# EAGLE design CC1101Adapter_V1_00 (EAGLE 6.4)
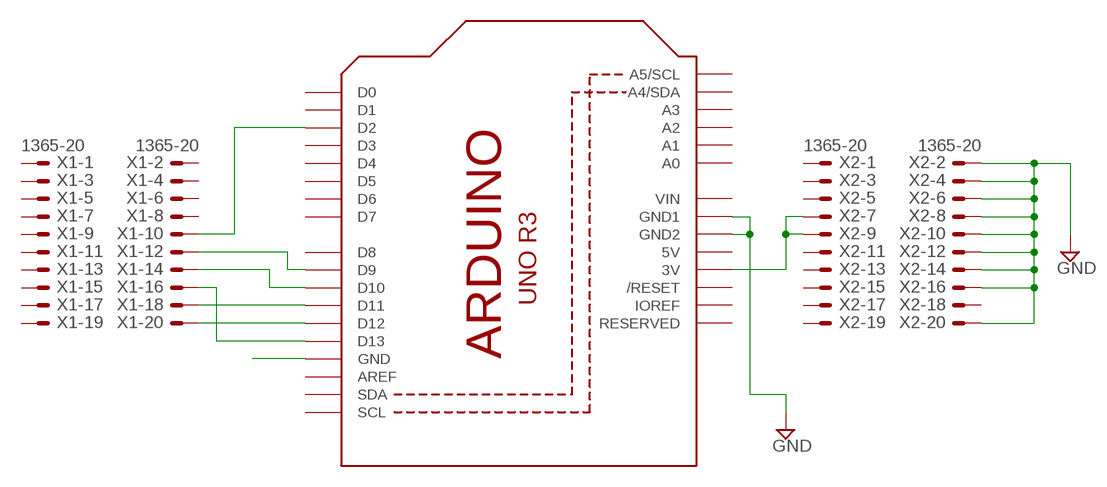
[diagram p0: schematic, sheet 1]

## Parts
U1  ARDUINOR3-DIMENSION  [ARDUINOR3]
X1  1365-20  [1365-20]
X2  1365-20  [1365-20]

## Nets
GND: U1.GND1 U1.GND2 X2.2 X2.4 X2.6 X2.8 X2.10 X2.12 X2.14 X2.16 X2.20
N$1: U1.D10 X1.14
N$2: U1.D11 X1.18
N$3: U1.D12 X1.20
N$4: U1.D13 X1.16
N$5: U1.D2 X1.10
N$6: U1.D9 X1.12
N$7: U1.3V X2.7 X2.9
N$8: U1.GND
Unconnected: U1.A0 U1.A1 U1.A2 U1.A3 U1.A4(A4/SDA) U1.A5(A5/SCL) U1.AREF U1.D0 U1.D1 U1.D3 U1.D4 U1.D5 U1.D6 U1.D7 U1.D8 U1.IOREF U1.RESERVED U1.RESET(/RESET) U1.SCL U1.SDA X1.1 X1.2 X1.3 X1.4 X1.5 X1.6 X1.7 X1.8 X1.9 X1.11 X1.13 X1.15 X1.17 X1.19 X2.1 X2.3 X2.5 X2.11 X2.13 X2.15 X2.17 X2.18 X2.19

## Power pins joined to a net without a drawn wire
5V: U1.5V
VIN: U1.VIN

## Library data of the parts
U1 = adafruit-fh:ARDUINOR3: This is a new object for the new Arduino R3 - with extra pins that you may want to use (such as IOref, and duplicated A4/A5
X1 X2 = con-leotronics:1365-20: DUAL ROW STRAIGHT HEADER 1364 SERIES. 1.27mm x 1.27mm. Without Fixing Post. SMT Source: http://www.leotronics.co.uk/Conexcon/Data%20Sheets/sec.%20A/1364ing.pdf; OC_FARNELL: unknown; OC_NEWARK: unknown

## Board
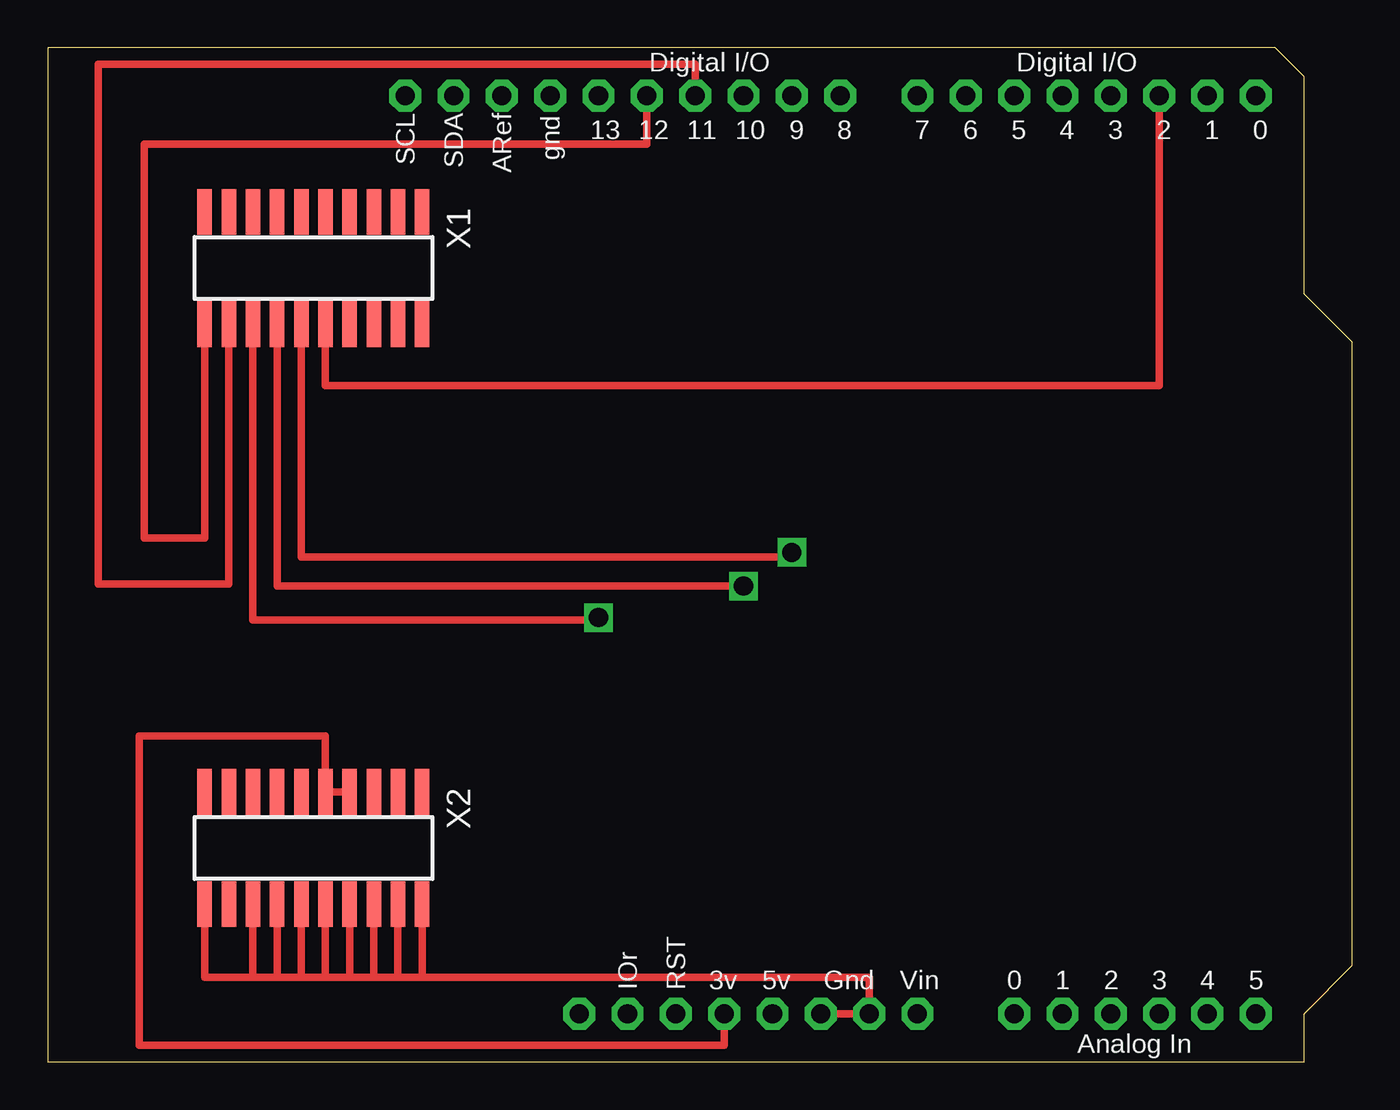
[diagram p1: board, top side]
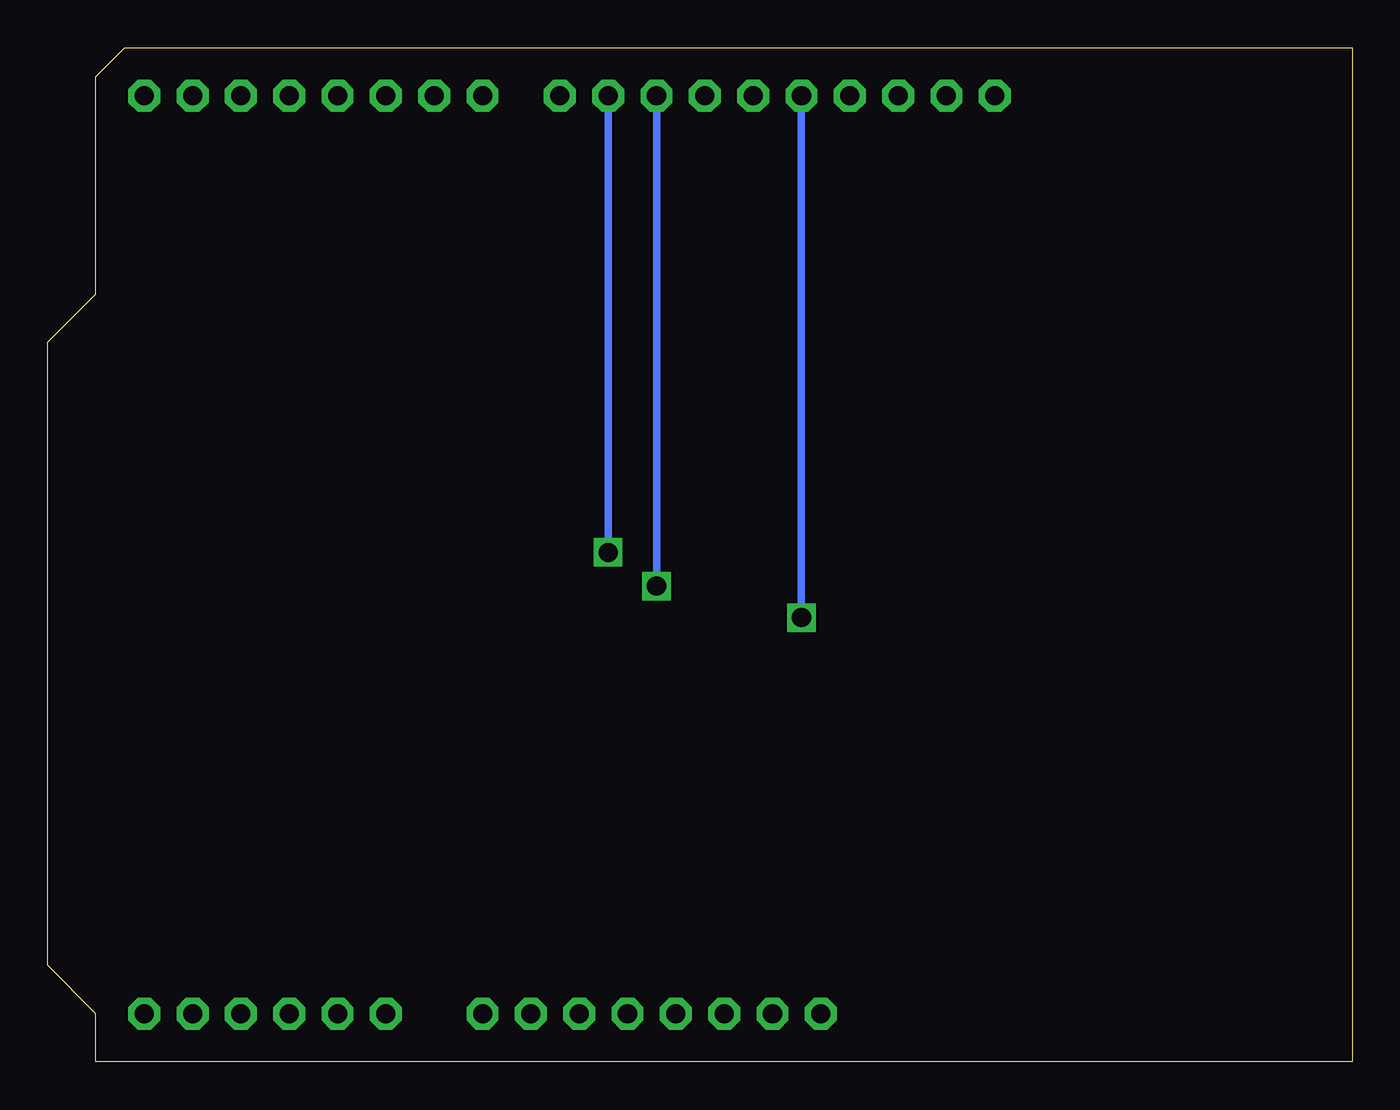
[diagram p2: board, bottom side, seen from below]

Size 68.58 x 53.34 mm. Coordinates in mm from the lower left corner, seen from the top.
Copper layers (1*16): Top 0.0356mm / dielectric 1.5011mm / Bottom 0.0356mm
Design rules "LaenPCBOrder": minimum track width 6mil, minimum drill 13mil, track to track 6mil, track to pad 6mil, pad to pad 6mil, via to via 6mil, smd to smd 6mil, copper to edge 15mil, drill to drill 6mil, minimum pad ring 7mil, minimum via ring 7mil, stop-mask expansion 4mil, vias tented up to drill 0mil, thermal gap 10mil

### Footprints (pad centres in the part's own frame; a part is rotated, then mirrored left to right if it is on the bottom)
ARDUINOR3 = drill 1 pad 1.676 octagon: 3V 35.56,2.54; 5V 38.1,2.54; A0 50.8,2.54; A1 53.34,2.54; A2 55.88,2.54; A3 58.42,2.54; A4 60.96,2.54; A5 63.5,2.54; AREF 23.876,50.8; D0 63.5,50.8; D1 60.96,50.8; D2 58.42,50.8; D3 55.88,50.8; D4 53.34,50.8; D5 50.8,50.8; D6 48.26,50.8; D7 45.72,50.8; D8 41.656,50.8; D9 39.116,50.8; D10 36.576,50.8; D11 34.036,50.8; D12 31.496,50.8; D13 28.956,50.8; GND 26.416,50.8; GND1 43.18,2.54; GND2 40.64,2.54; IOREF 30.48,2.54; RESERVED 27.94,2.54; RESET 33.02,2.54; SCL 18.796,50.8; SDA 21.336,50.8; VIN 45.72,2.54
1365-20 = smd 0.76 x 2.4: 1 -5.715,-2.95; 2 -5.715,2.95; 3 -4.445,-2.95; 4 -4.445,2.95; 5 -3.175,-2.95; 6 -3.175,2.95; 7 -1.905,-2.95; 8 -1.905,2.95; 9 -0.635,-2.95; 10 -0.635,2.95; 11 0.635,-2.95; 12 0.635,2.95; 13 1.905,-2.95; 14 1.905,2.95; 15 3.175,-2.95; 16 3.175,2.95; 17 4.445,-2.95; 18 4.445,2.95; 19 5.715,-2.95; 20 5.715,2.95

### Placement (x,y rotation side)
U1  0,0 0 top
X1  13.97,41.75 180 top
X2  13.97,11.25 180 top

### Tracks (layer width: path | path; a pad name or v marks a point on that pad's centre or on a via)
GND
  Top 0.406: U1.GND2 U1.GND1 43.18,4.45 19.68,4.45 | X2.20 8.26,4.45 10.79,4.45 | 10.79,4.45 12.06,4.45 | 12.06,4.45 13.34,4.45 | 13.34,4.45 14.61,4.45 | 14.61,4.45 15.88,4.45 | 15.88,4.45 17.14,4.45 | 17.14,4.45 18.41,4.45 | 18.41,4.45 19.68,4.45 | X2.2 19.68,4.45 | X2.4 18.41,4.45 | X2.6 17.14,4.45 | X2.8 15.88,4.45 | X2.10 14.61,4.45 | X2.12 13.34,4.45 | X2.14 12.06,4.45 | X2.16 10.79,4.45
N$1  (via drill 1)
  Top 0.406: X1.14 12.06,25.02 v36.58,25.02
  Bottom 0.406: v36.58,25.02 U1.D10
N$2
  Top 0.406: U1.D11 34.04,52.45 2.67,52.45 2.67,25.15 9.53,25.15 X1.18
N$3
  Top 0.406: X1.20 8.26,27.56 5.08,27.56 5.08,48.26 31.5,48.26 U1.D12
N$4  (via drill 1)
  Top 0.406: X1.16 10.79,23.24 28.96,23.24 v28.96,23.37
  Bottom 0.406: v28.96,23.37 U1.D13
N$5
  Top 0.406: U1.D2 58.42,35.56 14.61,35.56 X1.10
N$6  (via drill 1)
  Top 0.406: X1.12 13.34,26.54 39.12,26.54 v39.12,26.8
  Bottom 0.406: v39.12,26.8 U1.D9
N$7
  Top 0.406: U1.3V 35.56,0.89 4.83,0.89 4.83,17.14 14.61,17.14 X2.9 X2.7